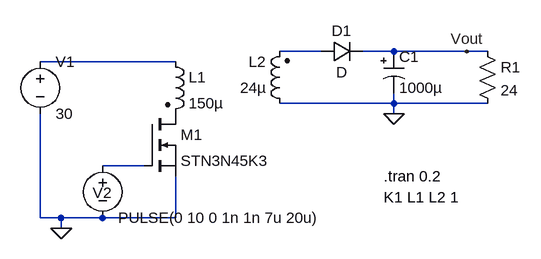
[diagram p0: schematic ParteA.asc]
ParteA.asc, the LTspice schematic file:
Version 4
SHEET 1 880 680
WIRE 528 48 464 48
WIRE 640 48 592 48
WIRE 752 48 640 48
WIRE 784 48 752 48
WIRE 304 64 96 64
WIRE 640 128 640 112
WIRE 640 128 464 128
WIRE 784 128 640 128
WIRE 640 144 640 128
WIRE 256 224 192 224
WIRE 96 304 96 144
WIRE 128 304 96 304
WIRE 192 304 128 304
WIRE 304 304 304 240
WIRE 304 304 192 304
WIRE 128 320 128 304
FLAG 128 320 0
FLAG 640 144 0
FLAG 752 48 Vout
SYMBOL voltage 96 48 R0
WINDOW 123 0 0 Left 0
WINDOW 39 0 0 Left 0
SYMATTR InstName V1
SYMATTR Value 30
SYMBOL ind2 288 48 R0
SYMATTR InstName L1
SYMATTR Value 150µ
SYMBOL voltage 192 208 R0
WINDOW 0 -15 57 Left 2
WINDOW 123 0 0 Left 0
WINDOW 39 0 0 Left 0
SYMATTR InstName V2
SYMATTR Value PULSE(0 10 0 1n 1n 7u 20u)
SYMBOL ind2 480 144 R180
WINDOW 0 36 80 Left 2
WINDOW 3 36 40 Left 2
SYMATTR InstName L2
SYMATTR Value 24µ
SYMBOL diode 528 64 R270
WINDOW 0 32 32 VTop 2
WINDOW 3 0 32 VBottom 2
SYMATTR InstName D1
SYMBOL res 768 32 R0
SYMATTR InstName R1
SYMATTR Value 24
SYMBOL polcap 624 48 R0
SYMATTR InstName C1
SYMATTR Value 1000µ
SYMBOL nmos 256 144 R0
SYMATTR InstName M1
SYMATTR Value STN3N45K3
TEXT 624 272 Left 2 !K1 L1 L2 1
TEXT 624 240 Left 2 !.tran 0.2

The netlist it stands for:
* ParteA.asc
V1 N002 0 30
L1 N002 P001 150µ
V2 N003 0 PULSE(0 10 0 1n 1n 7u 20u)
L2 0 N001 24µ
D1 N001 Vout D
R1 Vout 0 24
C1 Vout 0 1000µ
M1 P001 N003 0 0 STN3N45K3
.model D D
.lib standard.dio
.model NMOS NMOS
.model PMOS PMOS
.lib standard.mos
K1 L1 L2 1
.tran 0.2
.backanno
.end